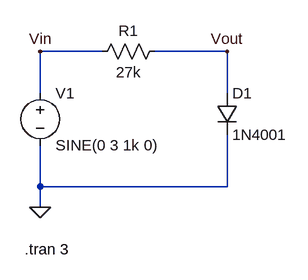
[diagram p0: schematic 311_lab2_p3.asc]
311_lab2_p3.asc, the LTspice schematic file:
Version 4
SHEET 1 880 680
WIRE 176 48 80 48
WIRE 368 48 256 48
WIRE 80 112 80 48
WIRE 368 112 368 48
WIRE 80 256 80 192
WIRE 368 256 368 176
WIRE 368 256 80 256
WIRE 80 288 80 256
FLAG 80 288 0
FLAG 80 48 Vin
FLAG 368 48 Vout
SYMBOL voltage 80 96 R0
WINDOW 123 0 0 Left 0
WINDOW 39 0 0 Left 0
SYMATTR InstName V1
SYMATTR Value SINE(0 3 1k 0)
SYMBOL diode 352 112 R0
SYMATTR InstName D1
SYMATTR Value 1N4001
SYMBOL res 272 32 R90
WINDOW 0 0 56 VBottom 2
WINDOW 3 32 56 VTop 2
SYMATTR InstName R1
SYMATTR Value 27k
TEXT 56 352 Left 2 !.tran 3

The netlist it stands for:
* 311_lab2_p3.asc
V1 Vin 0 SINE(0 3 1k 0)
D1 Vout 0 1N4001
R1 Vout Vin 27k
.model D D
.lib standard.dio
.tran 3
.backanno
.end